# Altium schematic sheet PC_module.SchDoc
size A4
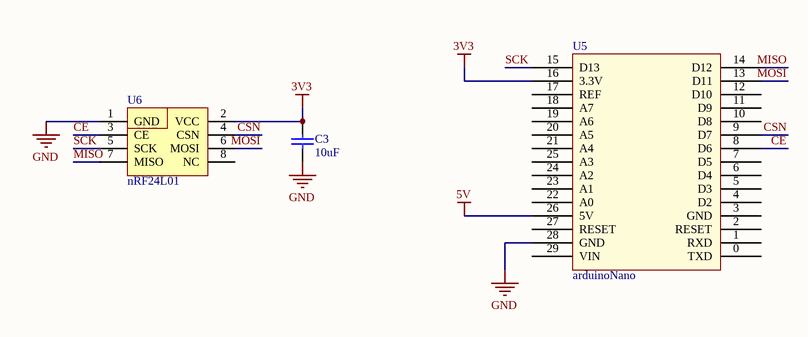
[diagram p0: PC_module.SchDoc]

## Parts
C3  10uF  [RAD-0.3]
U5  arduinoNano  [Arduino nano]
U6  nRF24L01

## Nets
3V3: C3.1 U5.16(3.3V) U6.2(VCC)
5V: U5.26(5V)
GND: C3.2 U5.28(GND) U6.1(GND)
CE: U5.8(D6) U6.3(CE)
CSN: U5.9(D7) U6.4(CSN)
MISO: U5.14(D12) U6.7(MISO)
MOSI: U5.13(D11) U6.6(MOSI)
SCK: U5.15(D13) U6.5(SCK)

Not connected (* = marked no-connect by the designer): U5 0(TXD) 1(RXD) 2(RESET) 3(GND) 4(D2) 5(D3) 6(D4) 7(D5) 10(D8) 11(D9) 12(D10) 17(REF) 18(A7) 19(A6) 20(A5) 21(A4) 22(A0) 23(A1) 24(A2) 25(A3) 27(RESET) 29(VIN); U6 8(NC)

## Library data of the parts
C3 = Cap: Capacitor; Published: 8-Jun-2000; LatestRevisionDate: 17-Jul-2002; LatestRevisionNote: Re-released for DXP Platform.; PackageReference: RAD-0.3; Publisher: Altium Limited; PackageDescription: Radial Cap, Thru-Hole; 2 Leads; 0.3 in Pin Spacing